# EAGLE schematic transmitter_crystal (EAGLE 9.6.2)
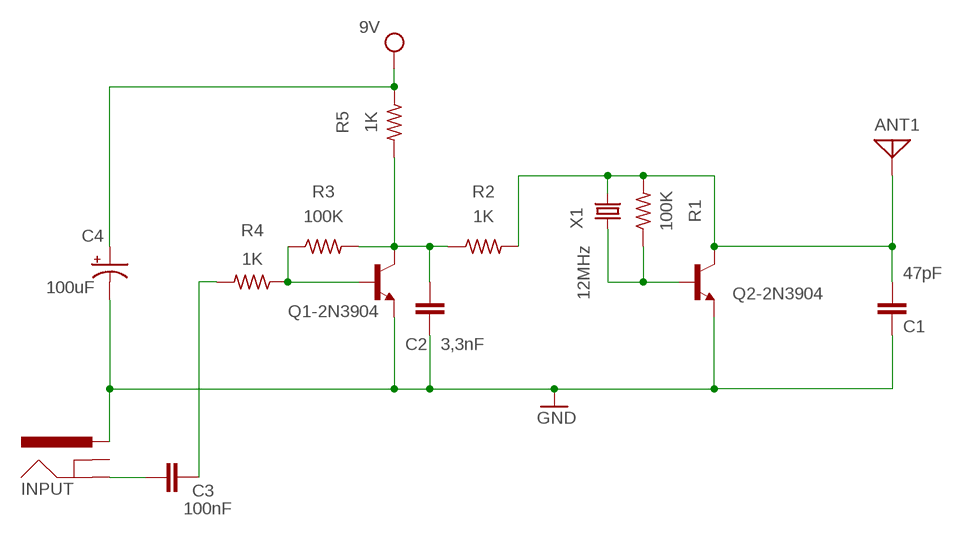
[diagram p0: schematic, sheet 1]

## Parts
ANT1  ANTENNA  [PAD-01]
C1  47pF  CXXC10B6  [XC10B6]
C2  3,3nF  CXXC10B6  [XC10B6]
C3  100nF  CXXC10B6  [XC10B6]
C4  100uF  100UF-POLAR-10X10.5-63V-20%  [NIC_10X10.5_CAP]
INPUT  POWER_JACKPTH_SMD_COMBO  [POWER_JACK_COMBO]
Q1-2N3904  200mA/40V  TRANS_NPN-2N3904  [TO-92]
Q2-2N3904  200mA/40V  TRANS_NPN-2N3904  [TO-92]
R1  100K  R-US_AXIAL-7.2MM-PITCH  [RESAD724W46L381D178B]
R2  1K  R-US_AXIAL-7.2MM-PITCH  [RESAD724W46L381D178B]
R3  100K  R-US_AXIAL-7.2MM-PITCH  [RESAD724W46L381D178B]
R4  1K  R-US_AXIAL-7.2MM-PITCH  [RESAD724W46L381D178B]
R5  1K  R-US_AXIAL-7.2MM-PITCH  [RESAD724W46L381D178B]
X1  12MHz  CRYSTAL68SMX  [86SMX]

## Nets
GND: C1.2 C2.2 C4.- INPUT.POWER(PWR) Q1-2N3904.1(E) Q2-2N3904.1(E)
N$1: C3.1 INPUT.GND@1(GND)
N$4: C2.1 Q1-2N3904.3(C) R2.1 R3.2 R5.2
N$5: Q1-2N3904.2(B) R3.1 R4.1
N$6: C3.2 R4.2
N$7: Q2-2N3904.2(B) R1.1 X1.1
N$8: ANT1.1 C1.1 Q2-2N3904.3(C) R1.2 R2.2 X1.4
VCC: C4.+ R5.1
Unconnected: INPUT.GND(GNDBREAK)

## Library data of the parts
ANT1 = discrete:ANTENNA: Antenna
C1-C3 = rcl:CX: X CAPACITOR for power line; SPICEPREFIX: C
C4 = SparkFun-Capacitors:100UF-POLAR: 100µF polarized capacitors A capacitor is a passive two-terminal electrical component used to store electrical energy temporarily in an electric field.; PROD_ID: CAP-08362
INPUT = SparkFun-Connectors:POWER_JACK: Power Jack Connector This is the standard 5.5mm barrel jack for power. The PTH is the most common, proven, reliable, footprint. The Slot footprint only works if the mill layer is transmitted to the PCB fab house so be warned. Here are the connectors we sell at SparkFun: DC Barrel Power Jack/Connector <https://www.sparkfun.com/products/119> (PRT-00119) DC Barrel Power Jack/Connector (SMD) <https://www.sparkfun.com/products/12748> (PRT-12748) DC Barrel Jack Adapter - Breadboard Compatible <https://www.sparkfun.com/products/10811> (PRT-10811) It is used on this SparkFun product (and many, many others): SparkFun RedBoard - Programmed with Arduino <https://www.sparkfun.com/products/12757> (DEV-12757) Also, if you need a mating power supply or connector, please check these out: Wall Adapter Power Supply - 9VDC 650mA <https://www.sparkfun.com/products/298> (TOL-00298) DC Barrel Jack Adapter - Male <https://www.sparkfun.com/products/10287> (PRT-10287)
Q1-2N3904 Q2-2N3904 = SparkFun-DiscreteSemi:TRANS_NPN: NPN transistor Current controlled devices typically used to amplify current or used as a switch. BC547 - COM-08928 <http://www.sparkfun.com/products/8928> (TO-92 45V 100mA) (1.Collector 2.Base 3.Emitter) 2N3904 - COM-00521 <http://www.sparkfun.com/products/521> (TO-92 40V 200mA) (1.Emitter 2.Base 3.Collector) P2N2222A - COM-12852 <http://www.sparkfun.com/products/12852> (TO-92 40V 600mA) (1.Collector 2.Base 3.Emitter); PROD_ID: TRANS-08447
R1-R5 = Resistor:R-US: Resistor Fixed - ANSI; CATEGORY: Resistor; SUB-CATEGORY: Fixed
X1 = adafruit:CRYSTAL: CRYSTAL; OC_FARNELL: 6344860; OC_NEWARK: unknown